# Altium schematic sheet CAN.SchDoc
size A4; SheetNumber: 3; SheetTotal: 2
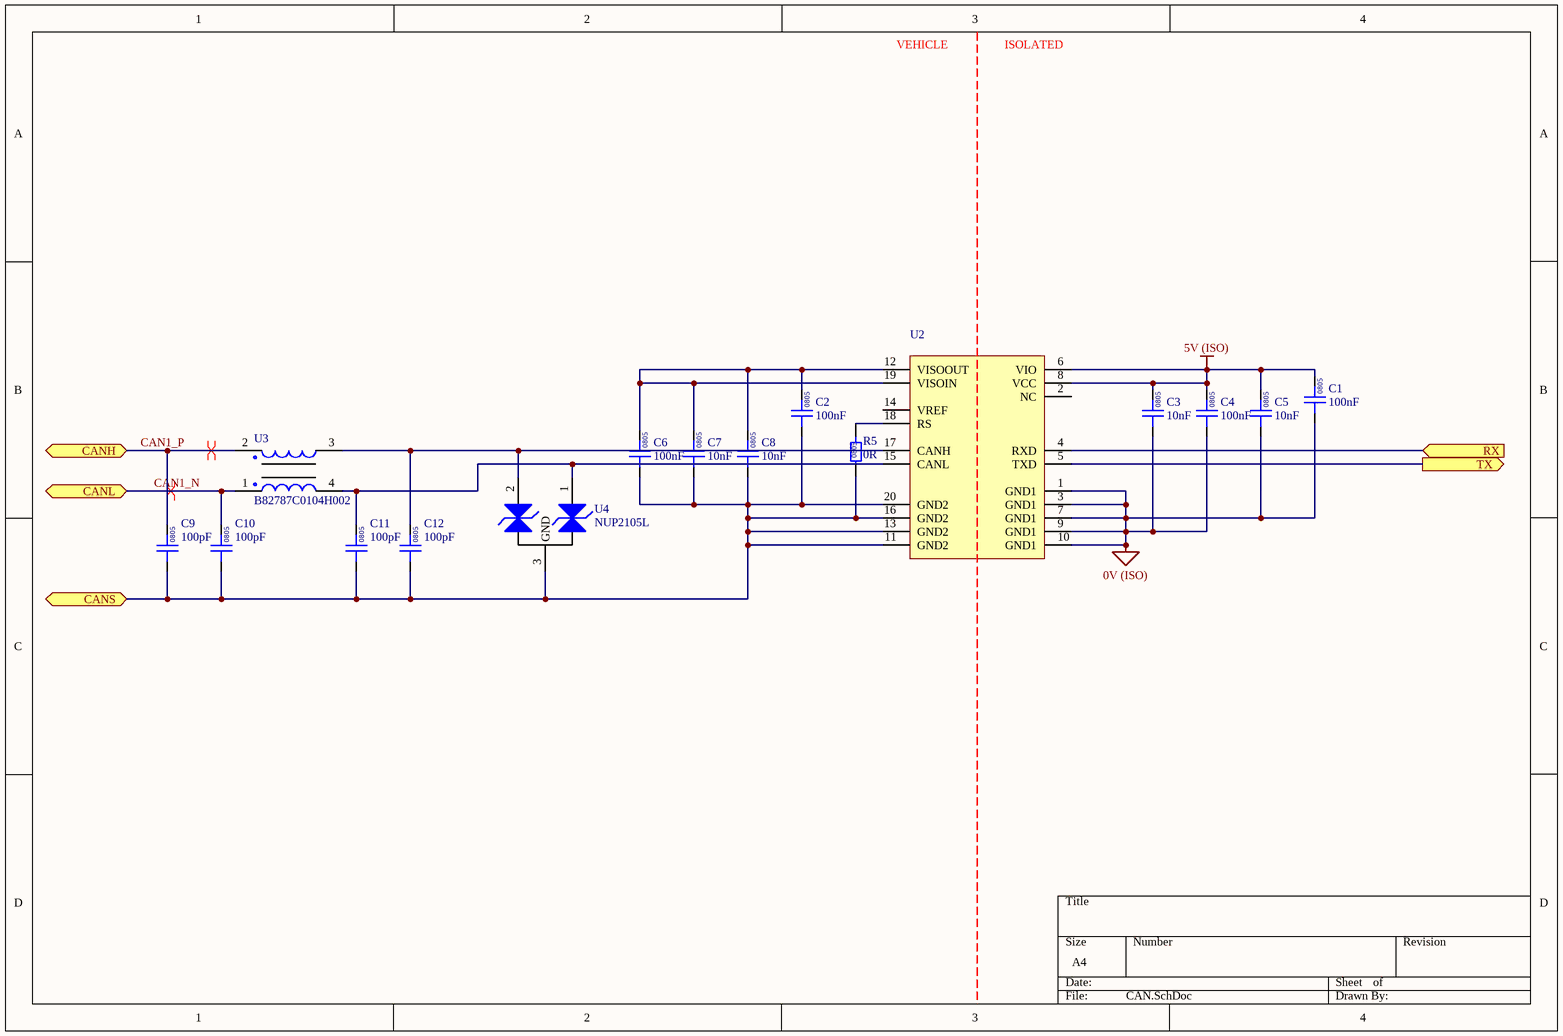
[diagram p0: CAN.SchDoc]

## Parts
C1  100nF  [0805]
C2  100nF  [0805]
C3  10nF  [0805]
C4  100nF  [0805]
C5  10nF  [0805]
C6  100nF  [0805]
C7  10nF  [0805]
C8  10nF  [0805]
C9  100pF  [0805]
C10  100pF  [0805]
C11  100pF  [0805]
C12  100pF  [0805]
R5  0R  [0805]
U2  (no value)  [AD SOIC-W 20]
U3  B82787C0104H002  [TDK 4-PC Pad]
U4  NUP2105L  [ON SOT-23]

## Ports
CANH (bidir), CANL (bidir), CANS (bidir), RX (in), TX (out)

## Nets
0V (ISO): C1.1 C3.1 C4.1 C5.1 U2.1(GND1) U2.3(GND1) U2.7(GND1) U2.9(GND1) U2.10(GND1)
5V (ISO): C1.2 C3.2 C4.2 C5.2 U2.6(VIO) U2.8(VCC)
CAN1_N: C10.2 U3.1 ; port CANL
CAN1_P: C9.2 U3.2 ; port CANH
CANS: C2.1 C6.1 C7.1 C8.1 C9.1 C10.1 C11.1 C12.1 R5.1 U2.11(GND2) U2.13(GND2) U2.16(GND2) U2.20(GND2) U4.3(GND) ; port CANS
RX: U2.4(RXD) ; port RX
TX: U2.5(TXD) ; port TX
NetC2_2: C2.2 C6.2 C7.2 C8.2 U2.12(VISOOUT) U2.19(VISOIN)
NetC11_2: C11.2 U2.15(CANL) U3.4 U4.1(CAN_H)
NetC12_2: C12.2 U2.17(CANH) U3.3 U4.2(CAN_L)
NetR5_2: R5.2 U2.18(RS)

Not connected (* = marked no-connect by the designer): U2 2(NC) 14(VREF)

## Layout directives
differential pair: CAN1_N, CAN1_P

## Notes on the sheet
- VEHICLE
- ISOLATED
- (in symbol GCM21BR71H104KA37L) 0805
- (in symbol GCM2165C1H101JA16D) 0805
- (in symbol GCM2195C1H103JA16D) 0805
- (in symbol RC0805FR070RL) 0805

## Library data of the parts
C1 C2 C4 C6 = GCM21BR71H104KA37L: Manufacturer: muRata; Tolerance: ±10%; Material: MLCC; Rated Voltage: 50V; Temperature Rating: X7R; Part Number: GCM21BR71H104KA37L; Value: 100nF; Digikey Part Number: 490-6064-1-ND
C3 C5 C7 C8 = GCM2195C1H103JA16D: Manufacturer: muRata; Tolerance: ±5%; Material: MLCC; Rated Voltage: 50V; Temperature Rating: C0G, NP0; Part Number: GCM2195C1H103JA16D; Value: 10nF; Digikey Part Number: 490-4783-1-ND
C9-C12 = GCM2165C1H101JA16D: Manufacturer: muRata; Tolerance: ±5%; Material: MLCC; Rated Voltage: 50V; Temperature Rating: C0G, NP0; Part Number: GCM2165C1H101JA16D; Value: 100pF; Digikey Part Number: 490-8031-1-ND
R5 = RC0805FR070RL: Manufacturer: YAGEO; Tolerance: 0.01; Rated Power: 0.125W; Part Number: RC0805FR070RL; Value: 0R; Material: FR-07; Digikey Part Number: 311-0.0CRCT-ND
U2 = ADM3053: Isolated CAN Transceiver; Manufacturer: Analogue Devices; Part Number: ADM3053; Digikey Part Number: ADM3053BRWZ-ND; Digikey Link: https://www.digikey.com/product-detail/en/analog-devices-inc/ADM3053BRWZ/ADM3053BRWZ-ND/2709332
U3 = B82787C0104H002: Manufacturer: EPCOS (TDK); Value: 100µH @ 100kHz; Impedance: 5.8 kOhms @ 10MHz; Rated Current: 150mA; Part Number: B82787C0104H002; Material: Wirewound; Digikey Part Number: 495-4598-1-ND
U4 = NUP2105L: Dual Line CAN Bus Protector; Manufacturer: ON Semiconductor; Part Number: NUP2105L; Digikey Part Number: NUP2105LT1GOSCT-ND; Digikey Link: https://www.digikey.com/product-detail/en/on-semiconductor/NUP2105LT1G/NUP2105LT1GOSCT-ND/1485001